# Altium schematic sheet Alimentação v3.SchDoc
size A4
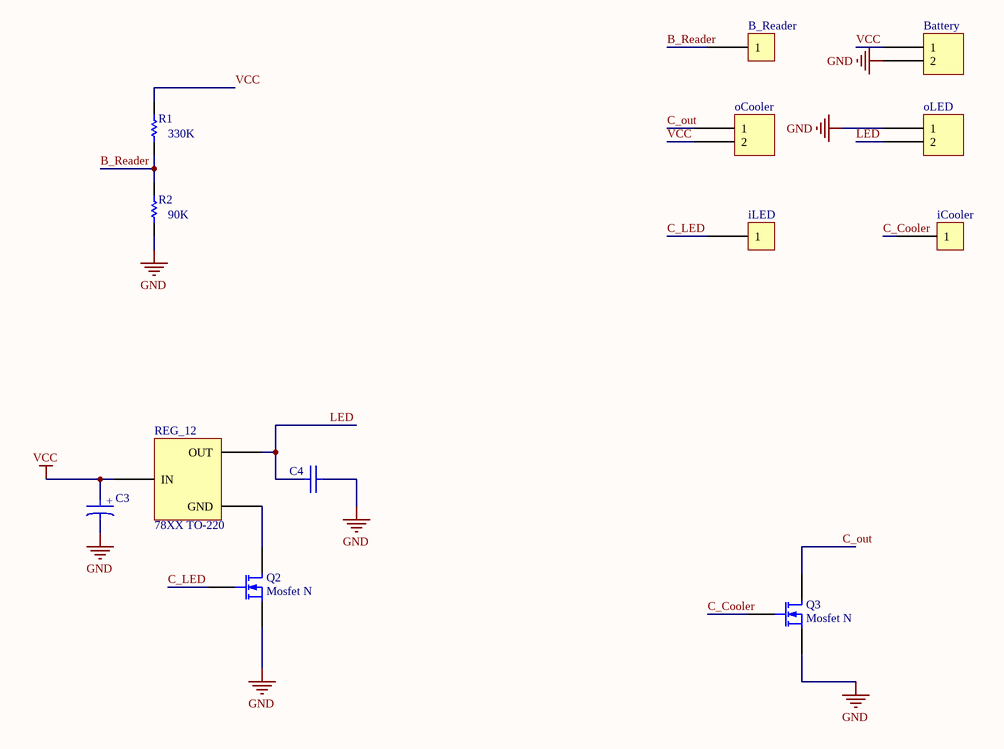
[diagram p0: Alimentação v3.SchDoc]

## Parts
B_Reader  *  [HEADER 1X1 8.5MM]  (value not drawn)
Battery  *  [XT90]  (value not drawn)
C3  *  [Eletrolytic Capacitor 5x5mm]  (value not drawn)
C4  *  [SMD Capacitor]  (value not drawn)
iCooler  *  [HEADER 1X1 8.5MM]  (value not drawn)
iLED  *  [HEADER 1X1 8.5MM]  (value not drawn)
oCooler  *  [KK2]  (value not drawn)
oLED  *  [KK2]  (value not drawn)
Q2  Mosfet N  [TO-220]
Q3  Mosfet N  [TO-220]
R1  value 330K  [RESISTOR THT 5mm]  (hidden comment: Resistor THT)
R2  value 90K  [RESISTOR THT 5mm]  (hidden comment: Resistor THT)
REG_12  78XX TO-220  [TO-220]

## Nets
GND: Battery.2 C3.2 C4.1 oLED.1 Q2.1(S) Q3.1(S) R2.1
VCC: Battery.1 C3.1 oCooler.2 R1.2 REG_12.1(IN)
B_Reader: B_Reader.1 R1.1 R2.2
C_Cooler: iCooler.1 Q3.2(G)
C_LED: iLED.1 Q2.2(G)
C_out: oCooler.1 Q3.3(D)
LED: C4.2 oLED.2 REG_12.3(OUT)
NetQ2_3: Q2.3(D) REG_12.2(GND)

## Notes on the sheet
- (in symbol Electrolytic Capacitor 0.33uF) +

## Library data of the parts
B_Reader iCooler iLED = Male Pin Head 1x1
Battery = XT90
C3 = Electrolytic Capacitor 0.33uF
C4 = Capacitor SMD 0805
oCooler oLED = KK2: KK Connector, 2 ways
Q2 Q3 = Mosfet N: Model: IRF3205